# EasyEDA schematic SCH_IoT STANDALONE_2024-02-11.json

## Sheets
1 LAYER1: TITLE: IoT Based Weather Station; REV: 1.0; Sheet: 1/1; Drawn By: arnoldmuhairwe; Company: MUHAIRWE
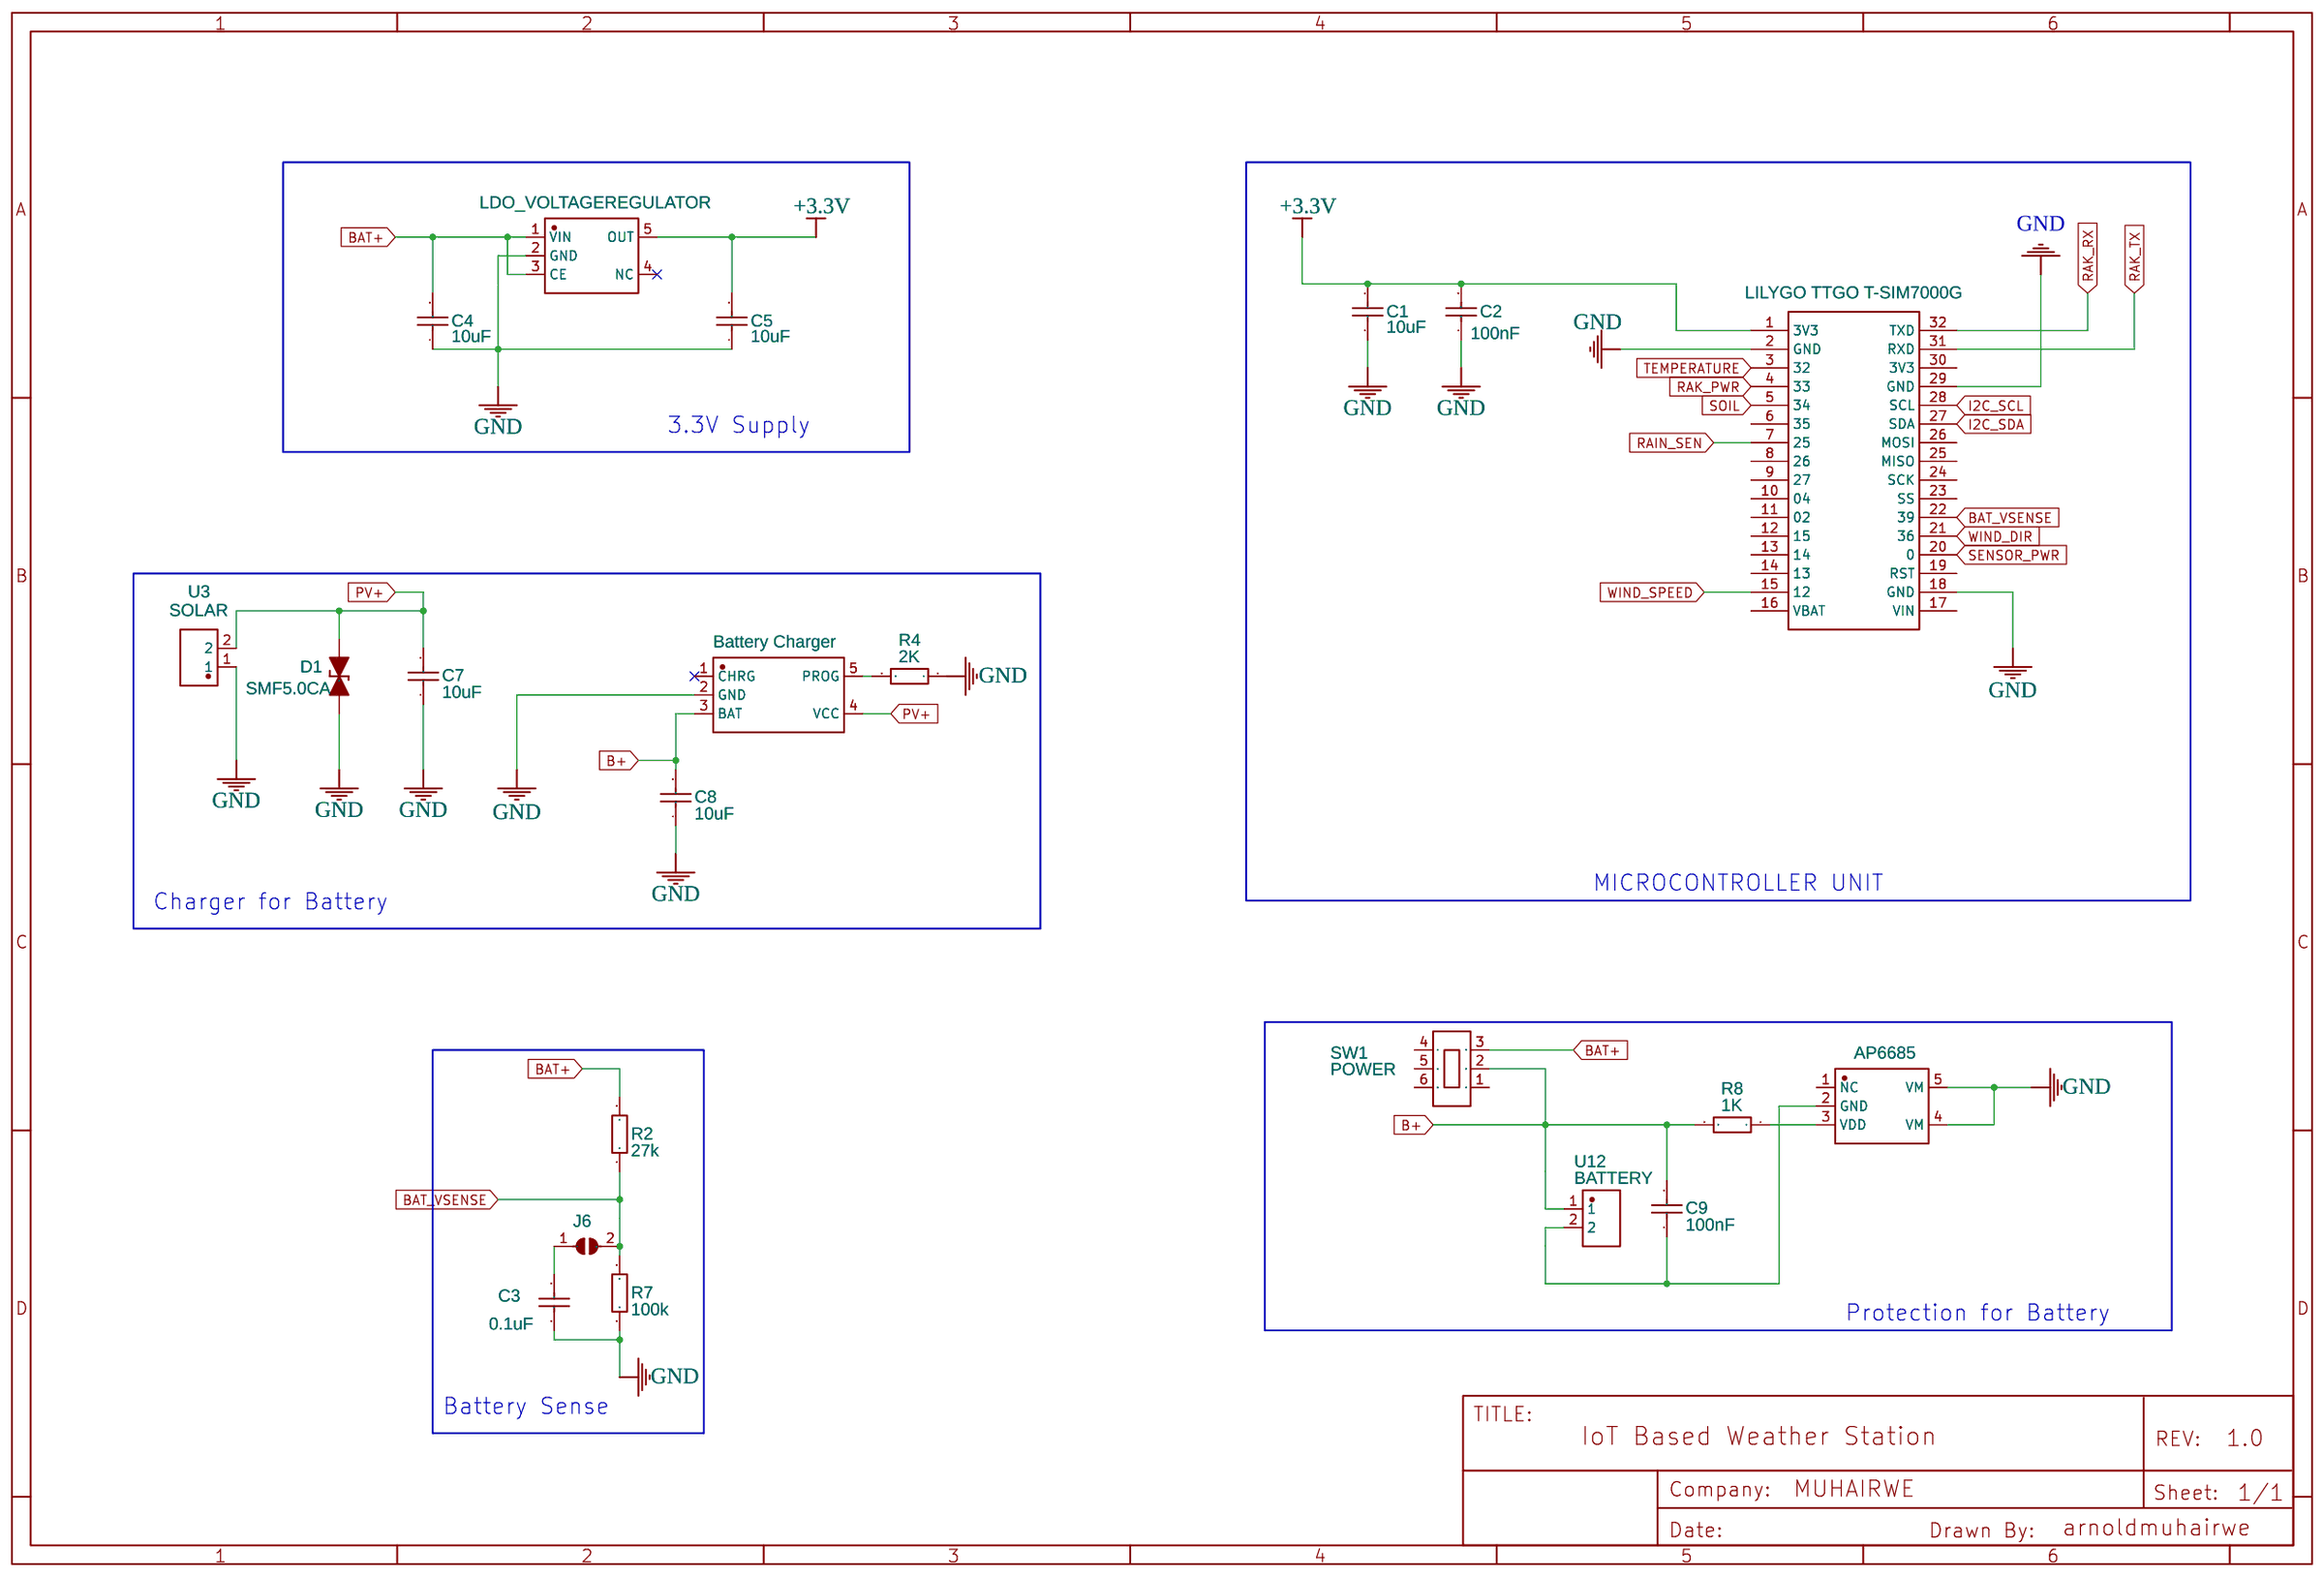
[diagram p0: LAYER1]
2 LAYER2
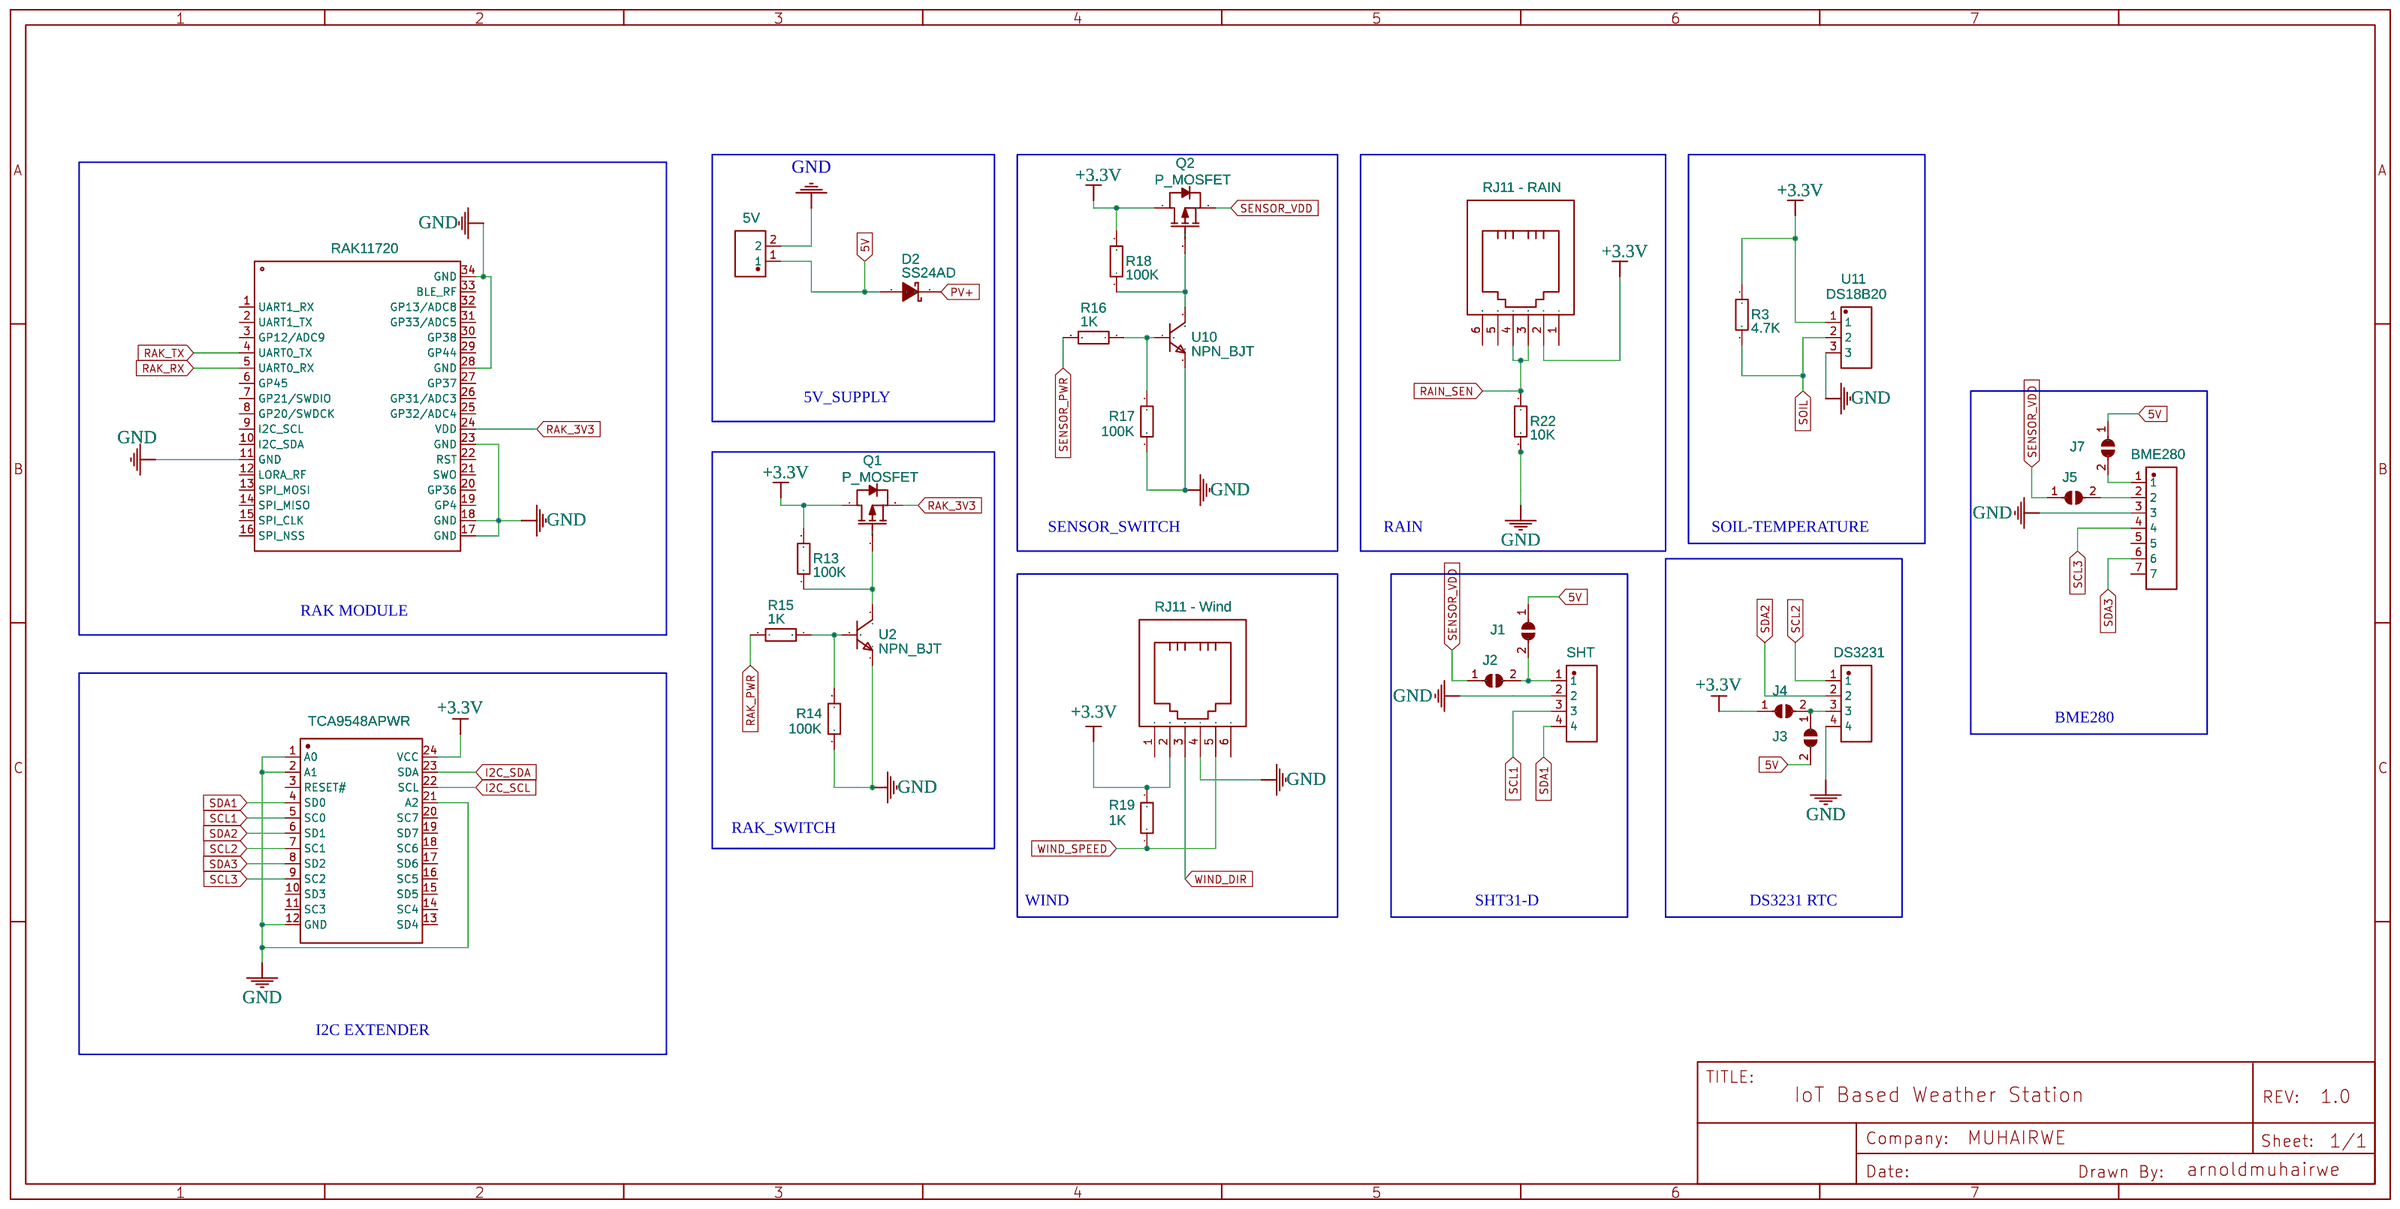
[diagram p1: LAYER2]

## Parts
sheet LAYER1
C1  10uF  [C0402]
C2  100nF  [C0402_NEW]
C3  0.1uF  [C0402_NEW]
C4  10uF  [C0402]
C5  10uF  [C0402]
C7  10uF  [C0402_NEW]
C8  10uF  [C0402_NEW]
C9  100nF  [C0402_NEW]
D1  SMF5.0CA  [SOD-123_L2.8-W1.8-LS3.7-BI]
J6  PAD-JUMPER-2  [PAD-JUMPER-2_1]
R2  27k  [R0402]
R4  2K  [R0402]
R7  100k  [R0402]
R8  1K  [R0402]
SW1  POWER  [SW-TH_MK-22D14-G020]
U1  LILYGO TTGO T-SIM7000G  [LILYGO TTGO T-SIM7000G]
U3  SOLAR  [CONN-TH_P5.00_KF127R-5.0-2P]
U5  Battery Charger  [SOT-23-5_L2.9-W1.6-P0.95-LS2.8-BR]
U7  LDO_VOLTAGEREGULATOR  [SOT-23-5_L2.9-W1.6-P0.95-LS2.8-BR]
U8  AP6685  [SOT-23-5_L3.0-W1.7-P0.95-LS2.8-BL]
U12  BATTERY  [CONN-TH_P5.00_KF127R-5.0-2P]
sheet LAYER2
CN1  BME280  [CONN-TH_7P-P2.54_C9900012194]
D2  SS24AD  [SMA_L4.3-W2.6-LS5.2-RD]
J1  PAD-JUMPER-2  [PAD-JUMPER-2_1]
J2  PAD-JUMPER-2  [PAD-JUMPER-2_1]
J3  PAD-JUMPER-2  [PAD-JUMPER-2_1]
J4  PAD-JUMPER-2  [PAD-JUMPER-2_1]
J5  PAD-JUMPER-2  [PAD-JUMPER-2_1]
J7  PAD-JUMPER-2  [PAD-JUMPER-2_1]
P1  SHT  [HDR-TH_4P-P2.54-V-M-1]
P2  DS3231  [HDR-TH_4P-P2.54-V-M-1]
Q1  P_MOSFET  [SOT-23-3_L2.9-W1.3-P1.90-LS2.4-BR]
Q2  P_MOSFET  [SOT-23-3_L2.9-W1.3-P1.90-LS2.4-BR]
R3  4.7K  [R0402]
R13  100K  [R0402]
R14  100K  [R0402]
R15  1K  [R0402]
R16  1K  [R0402]
R17  100K  [R0402]
R18  100K  [R0402]
R19  1K  [R0402]
R22  10K  [R0402]
RAINFALL1  RJ11 - RAIN  [RJ11-TH_DS1133-S60BPX]
U2  NPN_BJT  [SOT-23-3_L2.9-W1.3-P1.90-LS2.4-BR]
U4  TCA9548APWR  [TSSOP-24_L7.8-W4.4-P0.65-LS6.4-BL]
U9  RAK11720  [RAK11720]
U10  NPN_BJT  [SOT-23-3_L2.9-W1.3-P1.90-LS2.4-BR]
U11  DS18B20  [HEADER - HEADER-FEMALE-2.54_1X3]
U13  5V  [CONN-TH_P5.00_KF127R-5.0-2P]
WIND1  RJ11 - Wind  [RJ11-TH_FRJ11001-1100K6K20]

## Library data of the parts
C1 C4 C5 = CL05A106MQ5NUNC: Supplier: LCSC; Manufacturer: SAMSUNG; Supplier Part: C15525; JLCPCB Part Class: Basic Part
C2 = CL05B104KO5NNNC: Supplier: LCSC; Manufacturer: SAMSUNG; Supplier Part: C1525; JLCPCB Part Class: Basic Part
C3 C7-C9 = CL05B104KO5NNNC: Supplier: LCSC; Manufacturer: SAMSUNG; Supplier Part: C1525; JLCPCB Part Class: Basic Part; Package Display: No
D1 = SMF5.0CA: Supplier: LCSC; Supplier Part: C266716; Manufacturer: FMS(美丽微); Contributor: LCSC; JLCPCB Part Class: Extended Part
J1-J7 = PAD-JUMPER-2: Contributor: jason727.wang
R2-R4 R7 R8 R13-R19 R22 = 0402WGF2000TCE: Supplier: LCSC; Manufacturer: UniOhm; Supplier Part: C25087; JLCPCB Part Class: Basic Part
SW1 = MK-22D14-G020: Supplier: LCSC; Supplier Part: C963207; Manufacturer: G-Switch(品赞); Contributor: LCSC; JLCPCB Part Class: Extended Part
U1 = LILYGO TTGO T-SIM7000G: Contributor: mounir222
U3 U12 U13 = KF127R-5.0-2P: Supplier: LCSC; Supplier Part: C474908; Manufacturer: Cixi Kefa Elec; Contributor: LCSC; JLCPCB Part Class: Extended Part
U5 = LP4060AB5F-435: Supplier: LCSC; Supplier Part: C517026; Manufacturer: LOWPOWER(微源半导体); Contributor: LCSC; JLCPCB Part Class: Extended Part
U7 = XC6220B331MR: Supplier: LCSC; Supplier Part: C3040644; Manufacturer: TECH PUBLIC(台舟); link: https://atta.szlcsc.com/upload/public/pdf/source/20220630/EC7D0F989934709C5AE69B489B953B17.pdf; Contributor: lcsc
U8 = AP6685: Supplier: LCSC; Supplier Part: C2849566; Manufacturer: ALLPOWER(铨力); Contributor: LCSC
CN1 = 1*7PIN排间距2.54MM: Supplier: LCSC; Supplier Part: C9900012194; Manufacturer: null; Manufacturer Part: 1*7pin排间距2.54mm; Contributor: LCSC; JLCPCB Part Class: Extended Part; Package Display: No
D2 = SS24AD: Supplier: LCSC; Manufacturer: ST(先科); Supplier Part: C84503; JLCPCB Part Class: Extended Part
P1 P2 = HEADER_1*4P: Contributor: LCSC; Supplier: LCSC; Supplier Part: C9900003200; Manufacturer: null; JLCPCB Part Class: Extended Part; link: https://lcsc.com/eda_search?q=C9900003200&%26type=1&ref=editor
Q1 Q2 = SI2301S_C427389: Supplier: LCSC; Supplier Part: C427389; Manufacturer: MDD; Manufacturer Part: SI2301S; Contributor: LCSC; JLCPCB Part Class: Extended Part
RAINFALL1 = DS1133-S60BPX: Supplier: LCSC; Manufacturer: CONNFLY; Supplier Part: C77859; JLCPCB Part Class: Extended Part; Package Display: No
U2 U10 = MMBT3904Q: Supplier: LCSC; Supplier Part: C2942583; Manufacturer: YANGJIE(扬杰); Contributor: lcsc
U4 = TCA9548APWR: Supplier: LCSC; Manufacturer: TI(德州仪器); Supplier Part: C130026; JLCPCB Part Class: Extended Part; link: https://lcsc.com/eda_search?q=C130026&%26type=1&ref=editor
U9 = RAK11720: Manufacturer: RAKwireless; Manufacturer Part: RAKwireless; Supplier: rakwirelles; Supplier Part: RAK3172; Contributor: Berislav Vezilic; Link: https://store.rakwireless.com/collections/wisduo-module/products/wisduo-lpwan-module-rak3172?variant=40014759461062
U11 = HEADER - HEADER-FEMALE-2.54_1X3: Contributor: bszabo
WIND1 = FRJ11001-1100K6K20: Supplier: LCSC; Supplier Part: C456393; Manufacturer: TXGA(特思嘉); Contributor: LCSC; JLCPCB Part Class: Extended Part; Package Display: No

## Nets
5V: D2.2(A) J1.1(A) J3.2(B) J7.1(A) U13.1
+3.3V: C1.2 C2.2 C5.2 J4.1(A) Q1.3(D) Q2.3(D) R3.1 R13.2 R18.2 R19.2 RAINFALL1.2 U1.1(3V3) U4.24(VCC) U7.5(OUT) U11.1 WIND1.2
GND: C1.1 C2.1 C3.1 C4.1 C5.1 C7.1 C8.1 CN1.3 D1.1(K) P1.2 P2.4 R4.1 R7.1 R14.1 R17.1 R22.2 U1.2(GND) U1.18(GND) U1.29(GND) U2.2(E) U3.1 U4.1(A0) U4.2(A1) U4.12(GND) U4.21(A2) U5.2(GND) U7.2(GND) U8.4(VM) U8.5(VM) U9.11(GND) U9.17(GND) U9.18(GND) U9.23(GND) U9.28(GND) U9.34(GND) U10.2(E) U11.3 U13.2 WIND1.4
B+: C8.2 C9.2 R8.2 SW1.2 U5.3(BAT) U12.1
BAT+: C4.2 R2.2 SW1.3 U7.1(VIN) U7.3(CE)
BAT_VSENSE: J6.2(B) R2.1 R7.2 U1.22(39)
I2C_SCL: U1.28(SCL) U4.22(SCL)
I2C_SDA: U1.27(SDA) U4.23(SDA)
PV+: C7.2 D1.2(A) D2.1(C) U3.2 U5.4(VCC)
RAIN_SEN: R22.1 RAINFALL1.3 RAINFALL1.4 U1.7(25)
RAK_3V3: Q1.2(S) U9.24(VDD)
RAK_PWR: R15.2 U1.4(33)
RAK_RX: U1.32(TXD) U9.5(UART0_RX)
RAK_TX: U1.31(RXD) U9.4(UART0_TX)
SCL1: P1.3 U4.5(SC0)
SCL2: P2.1 U4.7(SC1)
SCL3: CN1.4 U4.9(SC2)
SDA1: P1.4 U4.4(SD0)
SDA2: P2.2 U4.6(SD1)
SDA3: CN1.6 U4.8(SD2)
SENSOR_PWR: R16.2 U1.20(0)
SENSOR_VDD: J2.1(A) J5.1(A) Q2.2(S)
SOIL: R3.2 U1.5(34) U11.2
TEMPERATURE: U1.3(32)
WIND_DIR: U1.21(36) WIND1.3
WIND_SPEED: R19.1 U1.15(12) WIND1.5
Net-(C3-2): C3.2 J6.1(A)
Net-(C9-1): C9.1 U8.2(GND) U12.2
Net-(CN1-1): CN1.1 J7.2(B)
Net-(CN1-2): CN1.2 J5.2(B)
Net-(J1-2): J1.2(B) J2.2(B) P1.1
Net-(J3-1): J3.1(A) J4.2(B) P2.3
Net-(Q1-1): Q1.1(G) R13.1 U2.3(C)
Net-(Q2-1): Q2.1(G) R18.1 U10.3(C)
Net-(R4-2): R4.2 U5.5(PROG)
Net-(R8-1): R8.1 U8.3(VDD)
Net-(R14-2): R14.2 R15.1 U2.1(B)
Net-(R16-1): R16.1 R17.2 U10.1(B)

Not connected (* = marked no-connect by the designer): CN1 5 7; RAINFALL1 1 5 6; SW1 1 4 5 6; U1 6(35) 8(26) 9(27) 10(04) 11(02) 12(15) 13(14) 14(13) 16(VBAT) 17(VIN) 19(RST) 23(SS) 24(SCK) 25(MISO) 26(MOSI) 30(3V3); U4 3(RESET#) 10(SD3) 11(SC3) 13(SD4) 14(SC4) 15(SD5) 16(SC5) 17(SD6) 18(SC6) 19(SD7) 20(SC7); U5 1(CHRG)*; U7 4(NC)*; U8 1(NC); U9 1(UART1_RX) 2(UART1_TX) 3(GP12/ADC9) 6(GP45) 7(GP21/SWDIO) 8(GP20/SWDCK) 9(I2C_SCL) 10(I2C_SDA) 12(LORA_RF) 13(SPI_MOSI) 14(SPI_MISO) 15(SPI_CLK) 16(SPI_NSS) 19(GP4) 20(GP36) 21(SWO) 22(RST) 25(GP32/ADC4) 26(GP31/ADC3) 27(GP37) 29(GP44) 30(GP38) 31(GP33/ADC5) 32(GP13/ADC8) 33(BLE RF); WIND1 1 6

## Notes on the sheets
sheet 1
- 3.3V Supply
- MICROCONTROLLER UNIT
- Charger for Battery
- Protection for Battery
- Battery Sense
sheet 2
- 5V_SUPPLY
- SENSOR_SWITCH
- RAIN
- SOIL-TEMPERATURE
- RAK MODULE
- BME280
- RAK_SWITCH
- WIND
- SHT31-D
- DS3231 RTC
- I2C EXTENDER
